# Altium project GameBoard_V1I1.PrjPcb (part 9 of 20)

## Sheet [14] - MCU.SchDoc
size A2; DocumentNumber: 14; SheetNumber: 14; SheetTotal: 32
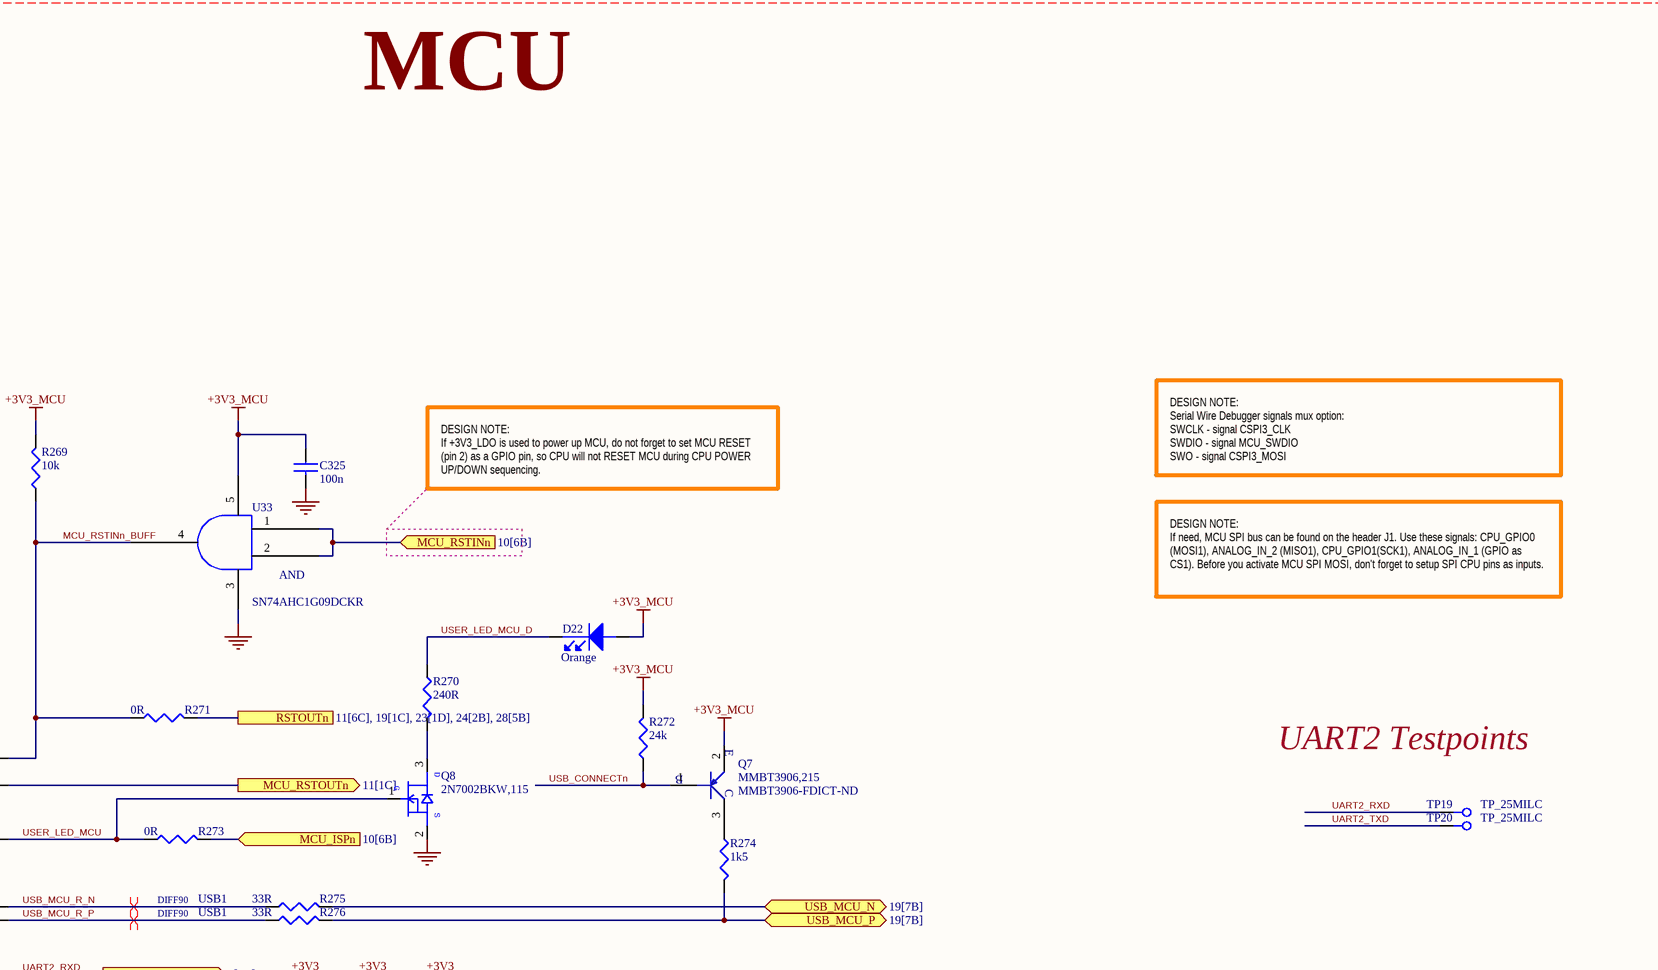
[diagram p54: [14] - MCU.SchDoc, top right]
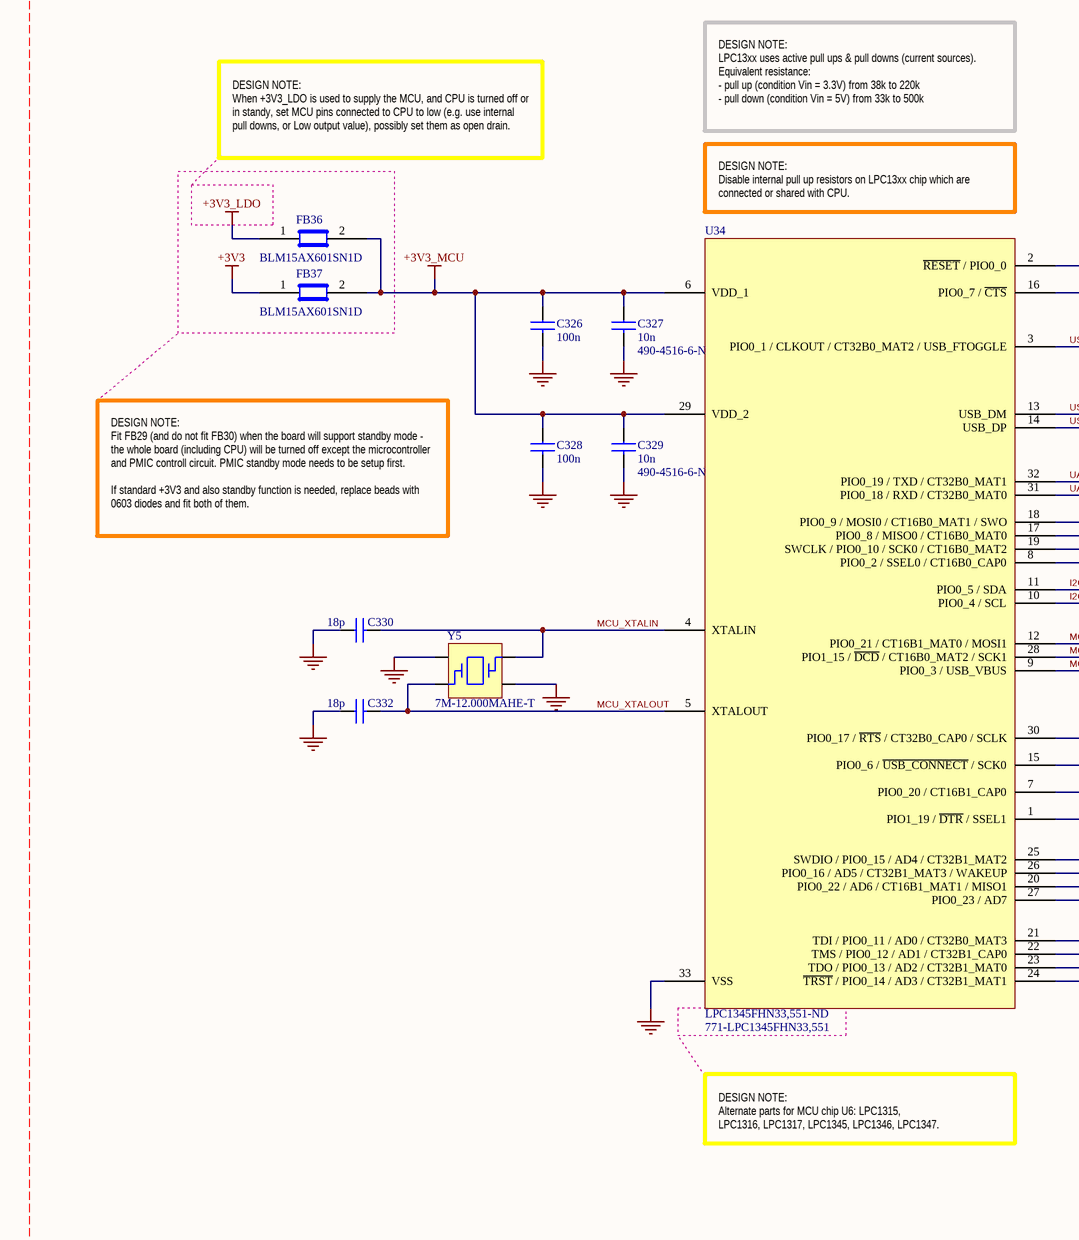
[diagram p55: [14] - MCU.SchDoc, bottom left]
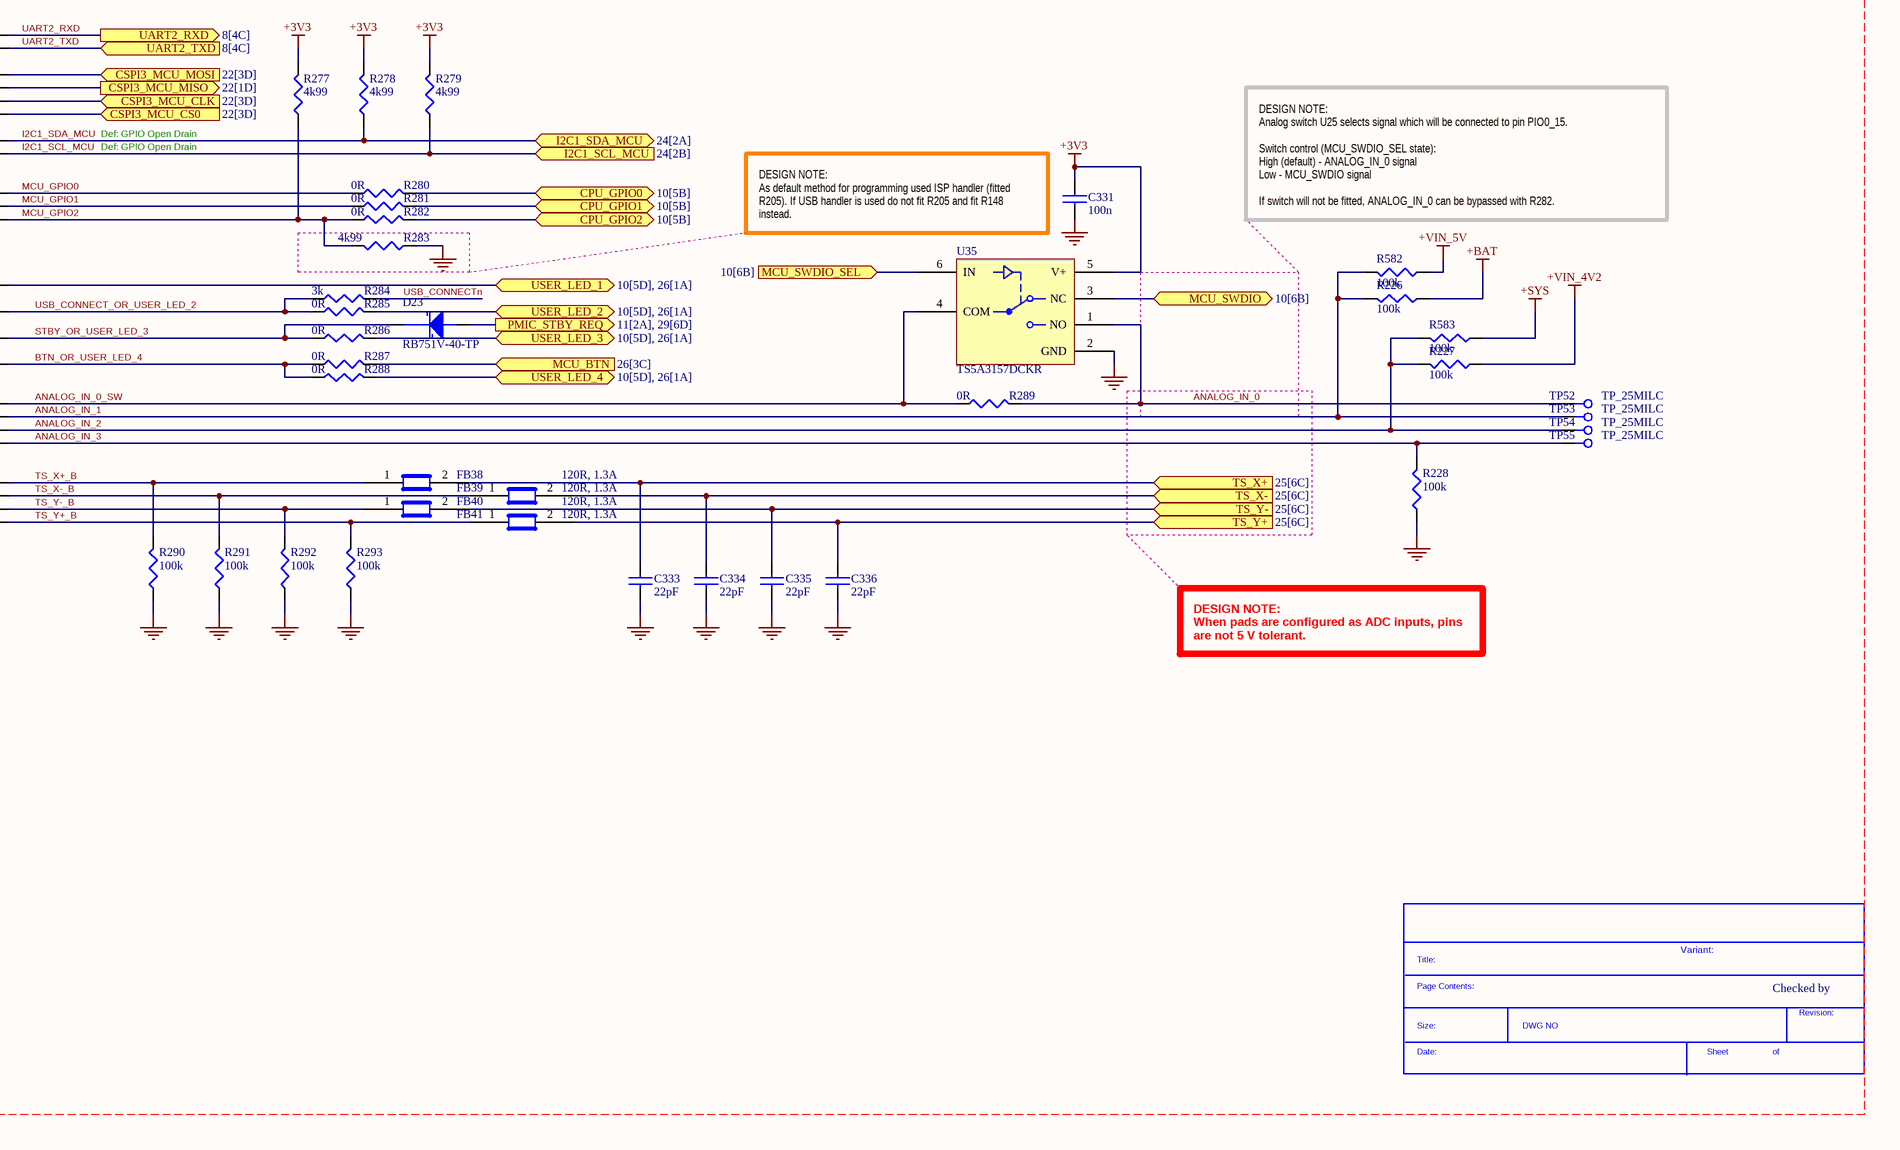
[diagram p56: [14] - MCU.SchDoc, bottom right]

### Parts
(Parts that share a designator on the sheet are numbered #1, #2 ... from top to bottom, then left to right.)
*#18  SDTitleBlock  (value not drawn)  (graphical)
C325  100n  [C0402]
C326  100n  [C0402]
C327  10n  Supplier Part Number 2: 490-4516-6-ND  [C0402]
C328  100n  [C0402]
C329  10n  Supplier Part Number 2: 490-4516-6-ND  [C0402]
C330  18p  [C0402]
C331  100n  [C0402]
C332  18p  [C0402]
C333  22pF  [C0402]
C334  22pF  [C0402]
C335  22pF  [C0402]
C336  22pF  [C0402]
D22  Orange  [LED_0603]
D23  RB751V-40-TP  [SOD323]
FB36  BLM15AX601SN1D  [C0402]
FB37  BLM15AX601SN1D  [C0402]
FB38  120R, 1.3A  [C0402]
FB39  120R, 1.3A  [C0402]
FB40  120R, 1.3A  [C0402]
FB41  120R, 1.3A  [C0402]
Q7  MMBT3906,215  Supplier Part Number 2: MMBT3906-FDICT-ND  [SOT-23-3-123]
Q8  2N7002BKW,115  [SC70_SOT323]
R226  100k  [R0402]
R227  100k  [R0402]
R228  100k  [R0402]
R269  10k  [R0402]
R270  240R  [R0402]
R271  0R  [R0402]
R272  24k  [R0402]
R273  0R  [R0402]
R274  1k5  [R0402]
R275  33R  [R0402]
R276  33R  [R0402]
R277  4k99  [R0402]
R278  4k99  [R0402]
R279  4k99  [R0402]
R280  0R  [R0402]
R281  0R  [R0402]
R282  0R  [R0402]
R283  4k99  [R0402]
R284  3k  [R0402]
R285  0R  [R0402]
R286  0R  [R0402]
R287  0R  [R0402]
R288  0R  [R0402]
R289  0R  [R0402]
R290  100k  [R0402]
R291  100k  [R0402]
R292  100k  [R0402]
R293  100k  [R0402]
R582  100k  [R0402]
R583  100k  [R0402]
TP19  TP_25MILC  [TP_25C]  (no BOM)
TP20  TP_25MILC  [TP_25C]  (no BOM)
TP52  TP_25MILC  [TP_25C]  (no BOM)
TP53  TP_25MILC  [TP_25C]  (no BOM)
TP54  TP_25MILC  [TP_25C]  (no BOM)
TP55  TP_25MILC  [TP_25C]  (no BOM)
U33  SN74AHC1G09DCKR  [SC70_5]
U34  LPC1345FHN33,551-ND  Supplier Part Number 2: 771-LPC1345FHN33,551  [HVQFN33_7x7mm]
U35  TS5A3157DCKR  [SC70_6]
Y5  7M-12.000MAHE-T  [7M]

### Ports
CPU_GPIO0 (bidir, see 10[5B]), CPU_GPIO1 (bidir, see 10[5B]), CPU_GPIO2 (bidir, see 10[5B]), CSPI3_MCU_CLK (in, see 22[3D]), CSPI3_MCU_CS0 (in, see 22[3D]), CSPI3_MCU_MISO (out, see 22[1D]), CSPI3_MCU_MOSI (in, see 22[3D]), I2C1_SCL_MCU (in, see 24[2B]), I2C1_SDA_MCU (bidir, see 24[2A]), MCU_BTN (in, see 26[3C]), MCU_ISPn (in, see 10[6B]), MCU_RSTINn (in, see 10[6B]), MCU_RSTOUTn (out, see 11[1C]), MCU_SWDIO (bidir, see 10[6B]), MCU_SWDIO_SEL (in, see 10[6B]), PMIC_STBY_REQ (out, see 11[2A], 29[6D]), RSTOUTn (see 11[6C], 19[1C], 23[1D], 24[2B], 28[5B]), TS_X+ (in, see 25[6C]), TS_X- (in, see 25[6C]), TS_Y+ (in, see 25[6C]), TS_Y- (in, see 25[6C]), UART2_RXD (out, see 8[4C]), UART2_TXD (in, see 8[4C]), USB_MCU_N (bidir, see 19[7B]), USB_MCU_P (bidir, see 19[7B]), USER_LED_1 (bidir, see 10[5D], 26[1A]), USER_LED_2 (bidir, see 10[5D], 26[1A]), USER_LED_3 (bidir, see 10[5D], 26[1A]), USER_LED_4 (bidir, see 10[5D], 26[1A])

### Nets
+3V3: C331.1 FB37.1 R277.2 R278.2 R279.2 U35.5(V+)
+3V3_LDO: FB36.1
+3V3_MCU: C325.1 C326.1 C327.1 C328.1 C329.1 D22.2(ANODE) FB36.2 FB37.2 Q7.2(E) R269.2 R272.2 U33.5(VCC) U34.6(VDD_1) U34.29(VDD_2)
+BAT: R226.1
+SYS: R583.1
+VIN_4V2: R227.1
+VIN_5V: R582.1
GND: C325.2 C326.2 C327.2 C328.2 C329.2 C330.1 C331.2 C332.1 C333.2 C334.2 C335.2 C336.2 Q8.2(SOURCE) R228.1 R283.1 R290.1 R291.1 R292.1 R293.1 U33.3(GND) U34.33(VSS) U35.2(GND) Y5.2 Y5.4
ANALOG_IN_0: R289.2 TP52.1 U35.1(NO)
ANALOG_IN_0_SW: R289.1 U34.25(SWDIO_/_PIO0_15_/_AD4_/_CT32B1_MAT2) U35.4(COM)
ANALOG_IN_1: R226.2 R582.2 TP53.1 U34.26(PIO0_16_/_AD5_/_CT32B1_MAT3_/_WAKEUP)
ANALOG_IN_2: R227.2 R583.2 TP54.1 U34.20(PIO0_22_/_AD6_/_CT16B1_MAT1_/_MISO1)
ANALOG_IN_3: R228.2 TP55.1 U34.27(PIO0_23_/_AD7)
BTN_OR_USER_LED_4: R287.1 R288.1 U34.1(PIO1_19_/_~{DTR}_/_SSEL1)
CPU_GPIO0: R280.2 ; port CPU_GPIO0
CPU_GPIO1: R281.2 ; port CPU_GPIO1
CPU_GPIO2: R282.2 ; port CPU_GPIO2
CSPI3_MCU_CLK: U34.19(SWCLK_/_PIO0_10_/_SCK0_/_CT16B0_MAT2) ; port CSPI3_MCU_CLK
CSPI3_MCU_CS0: U34.8(PIO0_2_/_SSEL0_/_CT16B0_CAP0) ; port CSPI3_MCU_CS0
CSPI3_MCU_MISO: U34.17(PIO0_8_/_MISO0_/_CT16B0_MAT0) ; port CSPI3_MCU_MISO
CSPI3_MCU_MOSI: U34.18(PIO0_9_/_MOSI0_/_CT16B0_MAT1_/_SWO) ; port CSPI3_MCU_MOSI
I2C1_SCL_MCU: R279.1 U34.10(PIO0_4_/_SCL) ; port I2C1_SCL_MCU
I2C1_SDA_MCU: R278.1 U34.11(PIO0_5_/_SDA) ; port I2C1_SDA_MCU
MCU_BTN: R287.2 ; port MCU_BTN
MCU_GPIO0: R280.1 U34.12(PIO0_21_/_CT16B1_MAT0_/_MOSI1)
MCU_GPIO1: R281.1 U34.28(PIO1_15_/_~{DCD}_/_CT16B0_MAT2_/_SCK1)
MCU_GPIO2: R277.1 R282.1 R283.2 U34.9(PIO0_3_/_USB_VBUS)
MCU_ISPn: R273.2 ; port MCU_ISPn
MCU_RSTINn: U33.1(A) U33.2(B) ; port MCU_RSTINn
MCU_RSTINn_BUFF: R269.1 R271.1 U33.4(Y) U34.2(~{RESET}_/_PIO0_0)
MCU_RSTOUTn: U34.16(PIO0_7_/_~{CTS}) ; port MCU_RSTOUTn
MCU_SWDIO: U35.3(NC) ; port MCU_SWDIO
MCU_SWDIO_SEL: U35.6(IN) ; port MCU_SWDIO_SEL
MCU_XTALIN: C330.2 U34.4(XTALIN) Y5.1
MCU_XTALOUT: C332.2 U34.5(XTALOUT) Y5.3
PMIC_STBY_REQ: D23.2(ANODE) ; port PMIC_STBY_REQ
RSTOUTn: R271.2 ; port RSTOUTn
STBY_OR_USER_LED_3: D23.1(cathode) R286.1 U34.7(PIO0_20_/_CT16B1_CAP0)
TS_X+: C333.1 FB38.2 ; port TS_X+
TS_X+_B: FB38.1 R290.2 U34.21(TDI_/_PIO0_11_/_AD0_/_CT32B0_MAT3)
TS_X-: C334.1 FB39.2 ; port TS_X-
TS_X-_B: FB39.1 R291.2 U34.22(TMS_/_PIO0_12_/_AD1_/_CT32B1_CAP0)
TS_Y+: C336.1 FB41.2 ; port TS_Y+
TS_Y+_B: FB41.1 R293.2 U34.24(~{TRST}_/_PIO0_14_/_AD3_/_CT32B1_MAT1)
TS_Y-: C335.1 FB40.2 ; port TS_Y-
TS_Y-_B: FB40.1 R292.2 U34.23(TDO_/_PIO0_13_/_AD2_/_CT32B1_MAT0)
UART2_RXD: TP19.1 U34.32(PIO0_19_/_TXD_/_CT32B0_MAT1) ; port UART2_RXD
UART2_TXD: TP20.1 U34.31(PIO0_18_/_RXD_/_CT32B0_MAT0) ; port UART2_TXD
USB_CONNECT_OR_USER_LED_2: R284.1 R285.1 U34.15(PIO0_6_/_~{USB_CONNECT}_/_SCK0)
USB_CONNECTn: Q7.1(B) R272.1 R284.2
USB_MCU_N: R275.2 ; port USB_MCU_N
USB_MCU_P: R274.2 R276.2 ; port USB_MCU_P
USB_MCU_R_N: R275.1 U34.13(USB_DM)
USB_MCU_R_P: R276.1 U34.14(USB_DP)
USER_LED_1: U34.30(PIO0_17_/_~{RTS}_/_CT32B0_CAP0_/_SCLK) ; port USER_LED_1
USER_LED_2: R285.2 ; port USER_LED_2
USER_LED_3: R286.2 ; port USER_LED_3
USER_LED_4: R288.2 ; port USER_LED_4
USER_LED_MCU: Q8.1(GATE) R273.1 U34.3(PIO0_1_/_CLKOUT_/_CT32B0_MAT2_/_USB_FTOGGLE)
USER_LED_MCU_D: D22.1(cathode) R270.1
NetQ7_3: Q7.3(C) R274.1
NetQ8_3: Q8.3(DRAIN) R270.2

### Layout directives
differential pair; net class DIFF90; net class USB1: USB_MCU_R_N, USB_MCU_R_P
net class [14] - MCU: +3V3, +3V3_LDO, +3V3_MCU, +BAT, +SYS, +VIN_4V2, +VIN_5V, ANALOG_IN_0, ANALOG_IN_0_SW, ANALOG_IN_1, ANALOG_IN_2, ANALOG_IN_3, BTN_OR_USER_LED_4, GND, I2C1_SCL_MCU, I2C1_SDA_MCU, MCU_GPIO0, MCU_GPIO1, MCU_GPIO2, MCU_RSTINn_BUFF, MCU_XTALIN, MCU_XTALOUT, STBY_OR_USER_LED_3, TS_X+_B, TS_X-_B, TS_Y+_B, TS_Y-_B, UART2_RXD, UART2_TXD, USB_CONNECT_OR_USER_LED_2, USB_CONNECTn, USB_MCU_R_N, USB_MCU_R_P, USER_LED_MCU, USER_LED_MCU_D

### Notes on the sheet
- MCU
- DESIGN NOTE:
  If +3V3_LDO is used to power up MCU, do not forget to set MCU RESET (pin 2) as a GPIO pin, so CPU will not RESET MCU during CPU POWER UP/DOWN sequencing.
- DESIGN NOTE:
  Serial Wire Debugger signals mux option:
  SWCLK - signal CSPI3_CLK
  SWDIO - signal MCU_SWDIO
  SWO - signal CSPI3_MOSI
- DESIGN NOTE:
  LPC13xx uses active pull ups & pull downs (current sources).
  Equivalent resistance:
  - pull up (condition Vin = 3.3V) from 38k to 220k
  - pull down (condition Vin = 5V) from 33k to 500k
- DESIGN NOTE:
  If need, MCU SPI bus can be found on the header J1. Use these signals: CPU_GPIO0 (MOSI1), ANALOG_IN_2 (MISO1), CPU_GPIO1(SCK1), ANALOG_IN_1 (GPIO as CS1). Before you activate MCU SPI MOSI, don't forget to setup SPI CPU pins as inputs.
- DESIGN NOTE:
  When +3V3_LDO is used to supply the MCU, and CPU is turned off or in standy, set MCU pins connected to CPU to low (e.g. use internal pull downs, or Low output value), possibly set them as open drain.
- DESIGN NOTE:
  Disable internal pull up resistors on LPC13xx chip which are connected or shared with CPU.
- UART2 Testpoints
- DESIGN NOTE:
  Fit FB29 (and do not fit FB30) when the board will support standby mode - the whole board (including CPU) will be turned off except the microcontroller and PMIC controll circuit. PMIC standby mode needs to be setup first.
  If standard +3V3 and also standby function is needed, replace beads with 0603 diodes and fit both of them.
- Def: GPIO Open Drain
- DESIGN NOTE:
  Analog switch U25 selects signal which will be connected to pin PIO0_15.
  Switch control (MCU_SWDIO_SEL state):
  High (default) - ANALOG_IN_0 signal
  Low - MCU_SWDIO signal
  If switch will not be fitted, ANALOG_IN_0 can be bypassed with R282.
- DESIGN NOTE:
  As default method for programming used ISP handler (fitted R205). If USB handler is used do not fit R205 and fit R148 instead.
- DESIGN NOTE:
  Alternate parts for MCU chip U6: LPC1315,
  LPC1316, LPC1317, LPC1345, LPC1346, LPC1347.
- DESIGN NOTE:
  When pads are configured as ADC inputs, pins are not 5 V tolerant.
- Variant:
- Checked by
- (in symbol 2N7002BKW,115) D; G; S
- (in symbol SDTitleBlock) Title:; Page Contents:; Revision:; Size:; DWG NO; Date:; Sheet; of
- (in symbol SN74AHC1G09DCKR) AND

### Library data of the parts
C325 C326 C328 C331 = C1005X5R1H104K: as C241 on sheet [19] - USB; Category: Capacitors; Manufacturer Part Number: C1005X5R1H104K; Operating Temperature: -55°C ~ 85°C; Package / Case: 0402 (1005 Metric); Price 1k [$]: 0.02340; .Checked SCH: used; Voltage - Rated: 50V; Supplier Part Number: 445-5942-1-ND; Supplier: Digikey; Supplier 1: Digi-Key; Supplier Part Number 1: 445-5942-1-ND; RoHS: RoHS Compliant; Stock 1: 106926; Pricing 1: 1=0.27, 10=0.18, 100=0.072, 250=0.05176, 500=0.0369, 1000=0.027 (USD); Tolerance: ±10%; Temperature Coefficient: X5R; Mounting Type: Surface Mount, MLCC; Applications: General Purpose; Ratings: -; Size / Dimension: 0.039" L x 0.020" W (1.00mm x 0.50mm); Height - Seated (Max): -; Thickness (Max): 0.022" (0.55mm); Lead Spacing: -; Features: -; Packaging: Cut Tape (CT); Lead Style: -; ComponentLink1URL: http://www.tdk.co.jp/tefe02/e412_c.pdf; ComponentLink1Description: http://www.tdk.co.jp/tefe02/e412_c.pdf; Supplier 2: Digi-Key; Supplier Part Number 2: 311-1697-6-ND
C327 C329 = C1005X7R1H103K: CAP CER 10000PF 50V 10% X7R 0402; Manufacturer: TDK Corporation; Value: 10nF; .Checked PCB: used; Capacitance: 10000pF; Category: Capacitors; Supplier Part Number: 445-6850-1-ND; Manufacturer Part Number: C1005X7R1H103K; Operating Temperature: -55°C ~ 125°C; Package / Case: 0402 (1005 Metric); Price 1k [$]: 0.01625; .Checked SCH: used; Voltage - Rated: 50V; Supplier: Digikey; Supplier 1: Digi-Key; Supplier Part Number 1: 445-6850-1-ND; RoHS: RoHS Compliant; Stock 1: 3901; Pricing 1: 1=0.2, 10=0.125, 100=0.045, 250=0.03252, 500=0.024, 1000=0.01625 (USD); Tolerance: ±10%; Temperature Coefficient: X7R; Mounting Type: Surface Mount, MLCC; Applications: General Purpose; Ratings: -; Size / Dimension: 0.039" L x 0.020" W (1.00mm x 0.50mm); Height - Seated (Max): -; Thickness (Max): 0.022" (0.55mm); Lead Spacing: -; Features: -; Packaging: Cut Tape (CT); Lead Style: -; ComponentLink1URL: http://www.tdk.co.jp/tefe02/e412_c.pdf; ComponentLink1Description: http://www.tdk.co.jp/tefe02/e412_c.pdf; Supplier 2: Digi-Key
C330 C332 = C1005C0G1H180J: as C247 on sheet [19] - USB; Capacitance: 18pF; Category: Capacitors; Supplier Part Number: 445-1238-1-ND; Manufacturer Part Number: C1005C0G1H180J; Operating Temperature: -55°C ~ 125°C; Package / Case: 0402 (1005 Metric); Price 1k [$]: 0.00468; Value: 18pF; .Checked SCH: used; Voltage - Rated: 50V; Supplier: Digikey; Supplier 1: Digi-Key; Supplier Part Number 1: 445-1238-1-ND; RoHS: RoHS Compliant; Stock 1: 24321; Pricing 1: 1=0.08, 10=0.05, 100=0.018, 250=0.013, 500=0.0096, 1000=0.0065 (USD); Tolerance: ±5%; Mounting Type: Surface Mount, MLCC; Applications: General Purpose; Ratings: -; Size / Dimension: 0.039" L x 0.020" W (1.00mm x 0.50mm); Height - Seated (Max): -; Thickness (Max): 0.022" (0.55mm); Lead Spacing: -; Features: -; Packaging: Cut Tape (CT); Lead Style: -; ComponentLink1URL: http://www.tdk.co.jp/tefe02/e412_c.pdf; ComponentLink1Description: http://www.tdk.co.jp/tefe02/e412_c.pdf
C333-C336 = C1005C0G1H220J: CAP CER 22PF 50V C0G 5% 0402; Manufacturer: TDK Corporation; .Checked PCB: used; Temperature Coefficient: C0G, NP0; Capacitance: 22pF; Category: Capacitors; Supplier Part Number: 445-1239-1-ND; Manufacturer Part Number: C1005C0G1H220J; Operating Temperature: -55°C ~ 125°C; Package / Case: 0402 (1005 Metric); Price 1k [$]: 0.00442; Value: 22pF; .Checked SCH: used; Voltage - Rated: 50V; Supplier: Digikey; Supplier 1: Digi-Key; Supplier Part Number 1: 445-1239-1-ND; RoHS: RoHS Compliant; Stock 1: 176261; Pricing 1: 1=0.08, 10=0.05, 100=0.018, 250=0.013, 500=0.0096, 1000=0.0065 (USD); Tolerance: ±5%; Mounting Type: Surface Mount, MLCC; Applications: General Purpose; Ratings: -; Size / Dimension: 0.039" L x 0.020" W (1.00mm x 0.50mm); Height - Seated (Max): -; Thickness (Max): 0.022" (0.55mm); Lead Spacing: -; Features: -; Packaging: Cut Tape (CT); Lead Style: -; ComponentLink1URL: http://www.tdk.co.jp/tefe02/e412_c.pdf; ComponentLink1Description: http://www.tdk.co.jp/tefe02/e412_c.pdf
D22 = LO L29K-H2K1-24-Z: as D11 on sheet [19] - USB; Supplier 1: Digi-Key; Supplier Part Number 1: 475-2740-1-ND; Manufacturer Part Number: LO L29K-H2K1-24-Z; RoHS: RoHS Compliant; Category: Optoelectronics; Stock 1: 15900; Pricing 1: 1=0.17, 10=0.141, 100=0.1127, 250=0.0986, 500=0.09016 (USD); Color: Orange; Wavelength - Dominant: 606nm; Package / Case: 0603 (1608 Metric); Size / Dimension: 1.70mm L x 0.80mm W; Height: 0.65mm; Mounting Type: Surface Mount; Packaging: Cut Tape (CT); ComponentLink1URL: http://catalog.osram-os.com/catalogue/catalogue.do;jsessionid=302CF83AF637AE24E40AEB0ADA267EDD?act=downloadFile&favOid=020000010003f9de000100b6; ComponentLink1Description: http://catalog.osram-os.com/catalogue/catalogue.do;jsessionid=302CF83AF637AE24E40AEB0ADA267EDD?act=downloadFile&favOid=020000010003f9de000100b6; .Checked SCH: used
D23 = RB751V-40-TP: DIODE SCHTKY 30MA 30V SOD-323; Manufacturer: Micro Commercial Co; Diode Type: Schottky; Voltage - Forward (Vf) (Max) @ If: 370mV @ 1mA; Speed: Small Signal =< 200mA (Io), Any Speed; Current - Reverse Leakage @ Vr: 500nA @ 30V; Capacitance @ Vr, F: 2pF @ 1V, 1MHz; .Checked PCB: used; Supplier 1: Digi-Key; Supplier Part Number 1: RB751V-40-TPMSCT-ND; Manufacturer Part Number: RB751V-40-TP; RoHS: RoHS Compliant; Category: Discrete Semiconductor Products; Stock 1: 18964; Pricing 1: 1=0.48, 10=0.342, 100=0.2014, 250=0.14252, 500=0.1216, 1000=0.095 (USD); Voltage - DC Reverse (Vr) (Max): 30V; Current - Average Rectified (Io): 30mA; Reverse Recovery Time (trr): -; Mounting Type: Surface Mount; Package / Case: SC-76, SOD-323; Supplier Device Package: SOD-323; Packaging: Cut Tape (CT); ComponentLink1URL: http://www.mccsemi.com/up_pdf/RB751V-40(SOD-323).PDF; ComponentLink1Description: Data Sheet; .Checked SCH: used
FB36 FB37 = BLM15AX601SN1D: FERRITE CHIP 600 OHM 0402 420mA; Manufacturer: Murata Electronics North America; .Checked PCB: used; Impedance @ Frequency: 600 Ohm @ 100MHz; DC Resistance (DCR): 340 mOhm Max; Filter Type: Differential Mode - Single; Number of Lines: 1; .Checked SCH: used; Category: Filters; Manufacturer Part Number: BLM15AX601SN1D; Package / Case: 0402 (1005 Metric); Current Rating: 420mA; Supplier 1: Digi-Key; Supplier Part Number 1: 490-5441-1-ND; RoHS: RoHS Compliant; Stock 1: 34008; Pricing 1: 1=0.26, 10=0.197, 50=0.1148, 100=0.0918, 250=0.0656, 500=0.0446, 1000=0.03608, 5000=0.02821 (USD); Mounting Type: Surface Mount; Packaging: Cut Tape (CT); Height (Max): 0.022" (0.55mm); Size / Dimension: 0.039" L x 0.020" W (1.00mm x 0.50mm); ComponentLink1URL: http://search.murata.co.jp/Ceramy/image/img/PDF/ENG/L0110S0100BLM15AX_SN.pdf; ComponentLink1Description: http://search.murata.co.jp/Ceramy/image/img/PDF/ENG/L0110S0100BLM15AX_SN.pdf; Supplier Part Number: 490-5441-1-ND; Price 1k [$]: 0.03280; Value: BLM15AX601SN1D; Supplier: Digikey
FB38-FB41 = BLM15PD121SN1D: FERRITE CHIP 120 OHM 1300MA 0402; Manufacturer: Murata Electronics North America; Impedance @ Frequency: 120 Ohm @ 100MHz; DC Resistance (DCR): 90 mOhm Max; Filter Type: Differential Mode - Single; .Checked PCB: used; .Creator: MM; Supplier 1: Digi-Key; Manufacturer Part Number: BLM15PD121SN1D; RoHS: RoHS Compliant; Category: Filters; Stock 1: 478960; Pricing 1: 1=0.12, 10=0.096, 50=0.0636, 100=0.0549, 250=0.04332, 500=0.03658, 1000=0.0308, 5000=0.02743 (USD); Packaging: Cut Tape (CT); Current Rating: 1.3A; Package / Case: 0402 (1005 Metric); Mounting Type: Surface Mount; Height (Max): 0.022" (0.55mm); Size / Dimension: 0.039" L x 0.020" W (1.00mm x 0.50mm); ComponentLink1URL: http://media.digikey.com/pdf/Data%20Sheets/Murata%20PDFs/BLM15P_Series.pdf; ComponentLink1Description: http://media.digikey.com/pdf/Data%20Sheets/Murata%20PDFs/BLM15P_Series.pdf; Supplier Part Number 1: 490-5203-1-ND; .Checked SCH: used
Q7 = MMBT3906,215: TRANS PNP 40V 0.2A SOT23; Manufacturer: NXP Semiconductors; Current - Collector (Ic) (Max): 200mA; Vce Saturation (Max) @ Ib, Ic: 400mV @ 5mA, 50mA; DC Current Gain (hFE) (Min) @ Ic, Vce: 100 @ 10mA, 1V; Power - Max: 250mW; Frequency - Transition: 250MHz; .Checked PCB: used; .Creator: MM; Supplier 1: Digi-Key; Manufacturer Part Number: MMBT3906,215; RoHS: RoHS Compliant; Category: Discrete Semiconductor Products; Stock 1: 39823; Pricing 1: 1=0.14, 10=0.125, 25=0.1132, 100=0.0816, 250=0.04804, 500=0.03986, 1000=0.02719 (USD); Packaging: Cut Tape (CT); Transistor Type: PNP; Voltage - Collector Emitter Breakdown (Max): 40V; Current - Collector Cutoff (Max): -; Mounting Type: Surface Mount; Package / Case: TO-236-3, SC-59, SOT-23-3; Supplier Device Package: SOT-23 (TO-236AB); ComponentLink1URL: http://www.nxp.com/documents/data_sheet/MMBT3906.pdf; ComponentLink1Description: http://www.nxp.com/documents/data_sheet/MMBT3906.pdf; Supplier Part Number 1: 568-4511-1-ND; .Checked SCH: used; Supplier 2: Digi-Key
Q8 = 2N7002BKW,115: MOSFET N-CH 60V 310MA SOT323; Manufacturer: NXP Semiconductors; FET Type: MOSFET N-Channel, Metal Oxide; FET Feature: Logic Level Gate; Rds On (Max) @ Id, Vgs: 1.6 Ohm @ 500mA, 10V; Vgs(th) (Max) @ Id: 2.1V @ 250µA; Gate Charge (Qg) @ Vgs: 0.6nC @ 4.5V; Input Capacitance (Ciss) @ Vds: 50pF @ 10V; Power - Max: 275mW; .Checked PCB: used; Supplier 1: Digi-Key; Supplier Part Number 1: 1727-4788-1-ND; Manufacturer Part Number: 2N7002BKW,115; RoHS: RoHS Compliant; Category: Discrete Semiconductor Products; Drain to Source Voltage (Vdss): 60V; Current - Continuous Drain (Id) @ 25° C: 310mA; Mounting Type: Surface Mount; Package / Case: SC-70, SOT-323; Supplier Device Package: SC-70; Packaging: Cut Tape (CT); ComponentLink1URL: http://www.nxp.com/documents/data_sheet/2N7002BKW.pdf; ComponentLink1Description: http://www.nxp.com/documents/data_sheet/2N7002BKW.pdf; .Checked SCH: used
R226-R228 R290-R293 R582 R583 = RMCF0402FT100K: as R183 on sheet [19] - USB; Category: Resistors; Supplier Part Number: RMCF0402FT100KCT-ND; Manufacturer Part Number: RMCF0402FT100K; Package / Case: 0402 (1005 Metric); Price 1k [$]: 0.00384; Resistance (Ohms): 100K; Tolerance: ±1%; Value: 100k; .Checked SCH: used; Supplier: Digikey; Supplier 1: Digi-Key; Supplier Part Number 1: YAG1343DKR-ND; RoHS: RoHS Compliant; Composition: Thick Film; Features: -; Size / Dimension: 0.039" L x 0.020" W (1.00mm x 0.50mm); Height: 0.016" (0.40mm); Number of Terminations: 2; Packaging: Cut Tape (CT); ComponentLink1URL: http://www.seielect.com/Catalog/SEI-RMCF.pdf; ComponentLink1Description: http://www.seielect.com/Catalog/SEI-RMCF.pdf
R269 = RC0402FR-0710KL: as R173 on sheet [19] - USB; Category: Resistors; Supplier Part Number: 311-10.0KLRCT-ND; Manufacturer Part Number: RC0402FR-0710KL; Package / Case: 0402 (1005 Metric); Price 1k [$]: 0.01421; Resistance (Ohms): 10K; Tolerance: ±1%; Value: 10k; .Checked SCH: used; Supplier: Digikey; Supplier 1: Digi-Key; Supplier Part Number 1: 311-10.0KLRCT-ND; RoHS: RoHS Compliant; Stock 1: 2916495; Pricing 1: 10=0.014, 50=0.0104, 100=0.0079, 250=0.00584, 500=0.00432, 1000=0.00288 (USD); Composition: Thick Film; Features: -; Size / Dimension: 0.039" L x 0.020" W (1.00mm x 0.50mm); Height: 0.016" (0.40mm); Number of Terminations: 2; Packaging: Cut Tape (CT); ComponentLink1URL: http://www.yageo.com/documents/recent/PYu-RC0402_51_RoHS_L_6.pdf; ComponentLink1Description: http://www.yageo.com/documents/recent/PYu-RC0402_51_RoHS_L_6.pdf
R270 = RMCF0402FT240R: RES TF 240 OHM 1% 0.0625W 0402; Manufacturer: Stackpole Electronics Inc; Resistance (Ohms): 240; Power (Watts): 0.063W, 1/16W; .Checked PCB: used; Temperature Coefficient: ±100ppm/°C; Category: Resistors; Supplier Part Number: RMCF0402FT240RCT-ND; Manufacturer Part Number: RMCF0402FT240R; Package / Case: 0402 (1005 Metric); Price 1k [$]: 0.00384; Tolerance: ±1%; Value: 240R; .Checked SCH: used; Supplier: Digikey; Supplier 1: Digi-Key; Supplier Part Number 1: RMCF0402FT240RCT-ND; RoHS: RoHS Compliant; Stock 1: 39860; Pricing 1: 1=0.04, 10=0.025, 50=0.0138, 100=0.0105, 250=0.0078, 500=0.00576, 1000=0.00384 (USD); Composition: Thick Film; Features: -; Size / Dimension: 0.039" L x 0.020" W (1.00mm x 0.50mm); Height: 0.016" (0.40mm); Number of Terminations: 2; Packaging: Cut Tape (CT); ComponentLink1URL: http://www.seielect.com/Catalog/SEI-RMCF.pdf; ComponentLink1Description: http://www.seielect.com/Catalog/SEI-RMCF.pdf
R271 R273 R280-R282 R285-R289 = RC0402JR-070RL: as R157-R160 on sheet [19] - USB; Category: Resistors; Supplier Part Number: 311-0.0JRCT-ND; Manufacturer Part Number: RC0402JR-070RL; Package / Case: 0402 (1005 Metric); Price 1k [$]: 0.01389; Value: 0R; .Checked SCH: used; Supplier: Digikey; Supplier 1: Digi-Key; Supplier Part Number 1: 311-0.0JRCT-ND; RoHS: RoHS Compliant; Stock 1: 1106330; Pricing 1: 10=0.012, 50=0.009, 100=0.0069, 250=0.00512, 500=0.0038, 1000=0.00253 (USD); Composition: Thick Film; Features: -; Temperature Coefficient: -; Size / Dimension: 0.039" L x 0.020" W (1.00mm x 0.50mm); Height: 0.016" (0.40mm); Number of Terminations: 2; Packaging: Cut Tape (CT); ComponentLink1URL: http://www.yageo.com/documents/recent/PYu-RC0402_51_RoHS_L_6.pdf; ComponentLink1Description: http://www.yageo.com/documents/recent/PYu-RC0402_51_RoHS_L_6.pdf
R272 = RC0402FR-0724KL: RES 24K OHM 1% 1/16W 0402; Manufacturer: Yageo; Power (Watts): 0.063W, 1/16W; Temperature Coefficient: ±100ppm/°C; .Creator: MM; .Checked PCB: used; Supplier 1: Digi-Key; Manufacturer Part Number: RC0402FR-0724KL; RoHS: RoHS Compliant; Category: Resistors; Stock 1: 85479; Pricing 1: 1=0.1, 10=0.013, 25=0.0096, 100=0.0054, 250=0.00412, 500=0.00328, 1000=0.00242, 2500=0.0021, 5000=0.00173 (USD); Packaging: Cut Tape (CT); Resistance (Ohms): 24k; Tolerance: ±1%; Composition: Thick Film; Features: Moisture Resistant; Operating Temperature: -55°C ~ 155°C; Package / Case: 0402 (1005 Metric); Supplier Device Package: 0402; Size / Dimension: 0.039" L x 0.020" W (1.00mm x 0.50mm); Height: 0.016" (0.40mm); Number of Terminations: 2; ComponentLink1URL: http://www.yageo.com/NewPortal/yageodocoutput?fileName=/pdf/R-Chip/PYu-RC_Group_51_RoHS_L_3.pdf; ComponentLink1Description: http://www.yageo.com/NewPortal/yageodocoutput?fileName=/pdf/R-Chip/PYu-RC_Group_51_RoHS_L_3.pdf; Supplier Part Number 1: 311-24KLRCT-ND; .Checked SCH: used; Supplier 2: Digi-Key; Supplier Part Number 2: P24KDCCT-ND
R274 = RC0402FR-071K5L: RES 1.50K OHM 1/16W 1% 0402 SMD; Manufacturer: Yageo; Resistance (Ohms): 1.5k; Power (Watts): 0.063W, 1/16W; Temperature Coefficient: ±100ppm/°C; .Creator: MM; .Checked PCB: used; Supplier 1: Digi-Key; Manufacturer Part Number: RC0402FR-071K5L; RoHS: RoHS Compliant; Category: Resistors; Stock 1: 499348; Pricing 1: 1=0.1, 10=0.014, 25=0.0104, 100=0.0063, 250=0.0054, 500=0.00382, 1000=0.0027, 2500=0.00234, 5000=0.00203 (USD); Packaging: Cut Tape (CT); Tolerance: ±1%; Composition: Thick Film; Features: -; Package / Case: 0402 (1005 Metric); Supplier Device Package: 0402; Size / Dimension: 0.039" L x 0.020" W (1.00mm x 0.50mm); Height: 0.016" (0.40mm); Number of Terminations: 2; ComponentLink1URL: http://www.yageo.com/documents/recent/PYu-RC0402_51_RoHS_L_6.pdf; ComponentLink1Description: http://www.yageo.com/documents/recent/PYu-RC0402_51_RoHS_L_6.pdf; Supplier Part Number 1: 311-1.50KLRCT-ND; .Checked SCH: used
R275 R276 = RMCF0402FT33R0: RES TF 33 OHM 1% 1/16W 0402; Manufacturer: Stackpole Electronics Inc; Resistance (Ohms): 33; Power (Watts): 0.063W, 1/16W; .Checked PCB: used; Temperature Coefficient: ±100ppm/°C; Category: Resistors; Supplier Part Number: RMCF0402FT33R0CT-ND; Manufacturer Part Number: RMCF0402FT33R0; Package / Case: 0402 (1005 Metric); Price 1k [$]: 0.00384; Tolerance: ±1%; Value: 33R; .Checked SCH: used; Supplier: Digikey; Supplier 1: Digi-Key; Supplier Part Number 1: RMCF0402FT33R0CT-ND; RoHS: RoHS Compliant; Stock 1: 26866; Pricing 1: 1=0.04, 10=0.025, 50=0.0138, 100=0.0105, 250=0.0078, 500=0.00576, 1000=0.00384 (USD); Composition: Thick Film; Features: -; Size / Dimension: 0.039" L x 0.020" W (1.00mm x 0.50mm); Height: 0.016" (0.40mm); Number of Terminations: 2; Packaging: Cut Tape (CT); ComponentLink1URL: http://www.seielect.com/Catalog/SEI-RMCF.pdf; ComponentLink1Description: http://www.seielect.com/Catalog/SEI-RMCF.pdf
R277-R279 R283 = RMCF0402FT4K99: RES TF 4.99K OHM 1% 1/16W 0402; Manufacturer: Stackpole Electronics Inc; Power (Watts): 0.063W, 1/16W; .Checked PCB: used; Temperature Coefficient: ±100ppm/°C; Category: Resistors; Supplier Part Number: RMCF0402FT4K99CT-ND; Manufacturer Part Number: RMCF0402FT4K99; Package / Case: 0402 (1005 Metric); Price 1k [$]: 0.00384; Resistance (Ohms): 4.99K; Tolerance: ±1%; Value: 4k99; .Checked SCH: used; Supplier: Digikey; Supplier 1: Digi-Key; Supplier Part Number 1: RMCF0402FT4K99CT-ND; RoHS: RoHS Compliant; Stock 1: 48509; Pricing 1: 1=0.04, 10=0.025, 50=0.0138, 100=0.0105, 250=0.0078, 500=0.00576, 1000=0.00384 (USD); Composition: Thick Film; Features: -; Size / Dimension: 0.039" L x 0.020" W (1.00mm x 0.50mm); Height: 0.016" (0.40mm); Number of Terminations: 2; Packaging: Cut Tape (CT); ComponentLink1URL: http://www.seielect.com/Catalog/SEI-RMCF.pdf; ComponentLink1Description: http://www.seielect.com/Catalog/SEI-RMCF.pdf
R284 = RC0402FR-073KL: RES 3K OHM 1/16W 1% 0402 SMD; Manufacturer: Yageo; Power (Watts): 0.063W, 1/16W; Temperature Coefficient: ±100ppm/°C; .Creator: MM; .Checked SCH: used; Supplier 1: Digi-Key; Manufacturer Part Number: RC0402FR-073KL; RoHS: RoHS Compliant; Category: Resistors; Stock 1: 194271; Pricing 1: 1=0.1, 10=0.014, 25=0.0104, 100=0.0063, 250=0.0054, 500=0.00382, 1000=0.0027, 2500=0.00234, 5000=0.00203 (USD); Packaging: Cut Tape (CT); Resistance (Ohms): 3k; Tolerance: ±1%; Composition: Thick Film; Features: -; Package / Case: 0402 (1005 Metric); Supplier Device Package: 0402; Size / Dimension: 0.039" L x 0.020" W (1.00mm x 0.50mm); Height: 0.016" (0.40mm); Number of Terminations: 2; ComponentLink1URL: http://www.yageo.com/documents/recent/PYu-RC0402_51_RoHS_L_6.pdf; ComponentLink1Description: http://www.yageo.com/documents/recent/PYu-RC0402_51_RoHS_L_6.pdf; Supplier Part Number 1: 311-3KLRCT-ND; .Checked PCB: used
TP19 TP20 TP52-TP55 = TP_25MILC: Test Point 25mil; .Checked PCB: used
U33 = SN74AHC1G09DCKR: IC GATE AND 1CH 2-INP SC-70-5; Manufacturer: Texas Instruments; Logic Type: AND Gate; Number of Circuits: 1; Number of Inputs: 2; Voltage - Supply: 2 V ~ 5.5 V; Current - Quiescent (Max): 1µA; Current - Output High, Low: -, 8mA; Logic Level - Low: 0.5 V ~ 1.65 V; Logic Level - High: 1.5 V ~ 3.85 V; Max Propagation Delay @ V, Max CL: 7.5ns @ 5V, 50pF; .Creator: MM; .Checked SCH: used; Supplier 1: Digi-Key; Manufacturer Part Number: SN74AHC1G09DCKR; RoHS: RoHS Compliant; Category: Integrated Circuits (ICs); Stock 1: 2059; Pricing 1: 1=0.49, 10=0.345, 25=0.2836, 100=0.2265, 250=0.165, 500=0.134, 750=0.11351, 1000=0.103 (USD); Packaging: Cut Tape (CT); Features: Open Drain; Operating Temperature: -55°C ~ 125°C; Mounting Type: Surface Mount; Supplier Device Package: SC-70-5; Package / Case: 6-TSSOP (5 Lead), SC-88A, SOT-353; ComponentLink1URL: http://www.ti.com/lit/ds/symlink/sn74ahc1g09.pdf; ComponentLink1Description: http://www.ti.com/lit/ds/symlink/sn74ahc1g09.pdf; Supplier Part Number 1: 296-29203-1-ND; .Checked PCB: used
U34 = LPC1345FHN33,551: IC MCU ARM 32KB FLASH 32HVQFN; Manufacturer: NXP Semiconductors; Core Processor: ARM® Cortex®-M3; Core Size: 32-Bit; Speed: 72MHz; Connectivity: I²C, Microwire, SPI, SSI, SSP, UART/USART, USB; Peripherals: Brown-out Detect/Reset, POR, WDT; Number of I/O: 26; Program Memory Size: 32KB (32K x 8); EEPROM Size: 2K x 8; RAM Size: 10K x 8; Voltage - Supply (Vcc/Vdd): 2 V ~ 3.6 V; Data Converters: A/D 8x12b; Oscillator Type: Internal; .Checked PCB: used; .Creator: MM; Supplier 1: Digi-Key; Manufacturer Part Number: LPC1345FHN33,551; RoHS: RoHS Compliant; Category: Integrated Circuits (ICs); Stock 1: 0; Pricing 1: 260=3.2745 (USD); Packaging: Tray; Program Memory Type: FLASH; Operating Temperature: -40°C ~ 85°C; Package / Case: 32-VQFN Exposed Pad; Supplier Device Package: 32-HVQFN (7x7); ComponentLink1URL: http://www.nxp.com/documents/data_sheet/LPC1315_16_17_45_46_47.pdf; ComponentLink1Description: http://www.nxp.com/documents/data_sheet/LPC1315_16_17_45_46_47.pdf; Supplier Part Number 1: LPC1345FHN33,551-ND; .Checked SCH: used; Supplier 2: Mouser
U35 = TS5A3157DCKR: IC SWITCH SPDT SC70-6; Manufacturer: Texas Instruments; Circuit: 1 x SPDT; On-State Resistance: 10 Ohm; Voltage Supply Source: Single Supply; Voltage - Supply, Single/Dual (±): 1.65 V ~ 5.5 V; Current - Supply: 2.5µA; .Checked PCB: used; .Creator: MM; Supplier 1: Digi-Key; Manufacturer Part Number: TS5A3157DCKR; RoHS: RoHS Compliant; Category: Integrated Circuits (ICs); Stock 1: 2204; Pricing 1: 1=0.42, 10=0.325, 100=0.171, 1000=0.153 (USD); Packaging: Cut Tape (CT); Function: Switch; Operating Temperature: -40°C ~ 85°C; Mounting Type: Surface Mount; Package / Case: 6-TSSOP, SC-88, SOT-363; Supplier Device Package: SC-70-6; ComponentLink1URL: http://www.ti.com/lit/ds/symlink/ts5a3157.pdf; ComponentLink1Description: http://www.ti.com/lit/ds/symlink/ts5a3157.pdf; Supplier Part Number 1: 296-17588-1-ND; .Checked SCH: used
Y5 = 7M-12.000MAHE-T: CRYSTAL 12MHZ 12PF SMD; Manufacturer: TXC CORPORATION; Frequency Stability: ±30ppm; ESR (Equivalent Series Resistance): 100 Ohm; Operating Mode: Fundamental; .Creator: MM; .Checked PCB: used; Supplier 1: Digi-Key; Manufacturer Part Number: 7M-12.000MAHE-T; RoHS: RoHS Compliant; Category: Crystals and Oscillators; Stock 1: 2813; Pricing 1: 1=0.96, 10=0.847, 50=0.791, 100=0.7, 500=0.6615, 1000=0.553 (USD); Packaging: Cut Tape (CT); Type: MHz Crystal; Frequency: 12MHz; Frequency Tolerance: ±30ppm; Load Capacitance: 12pF; Operating Temperature: -40°C ~ 85°C; Ratings: -; Mounting Type: Surface Mount; Package / Case: 4-SMD, No Lead (DFN, LCC); Size / Dimension: 0.126" L x 0.098" W (3.20mm x 2.50mm); Height: 0.031" (0.80mm); ComponentLink1URL: http://www.txccrystal.com/images/pdf/7m.pdf; ComponentLink1Description: http://www.txccrystal.com/images/pdf/7m.pdf; Supplier Part Number 1: 887-1775-1-ND; .Checked SCH: used

## Sheet [20] - ETHERNET, SATA.SchDoc
size A3; DocumentNumber: 20; SheetNumber: 20; SheetTotal: 32
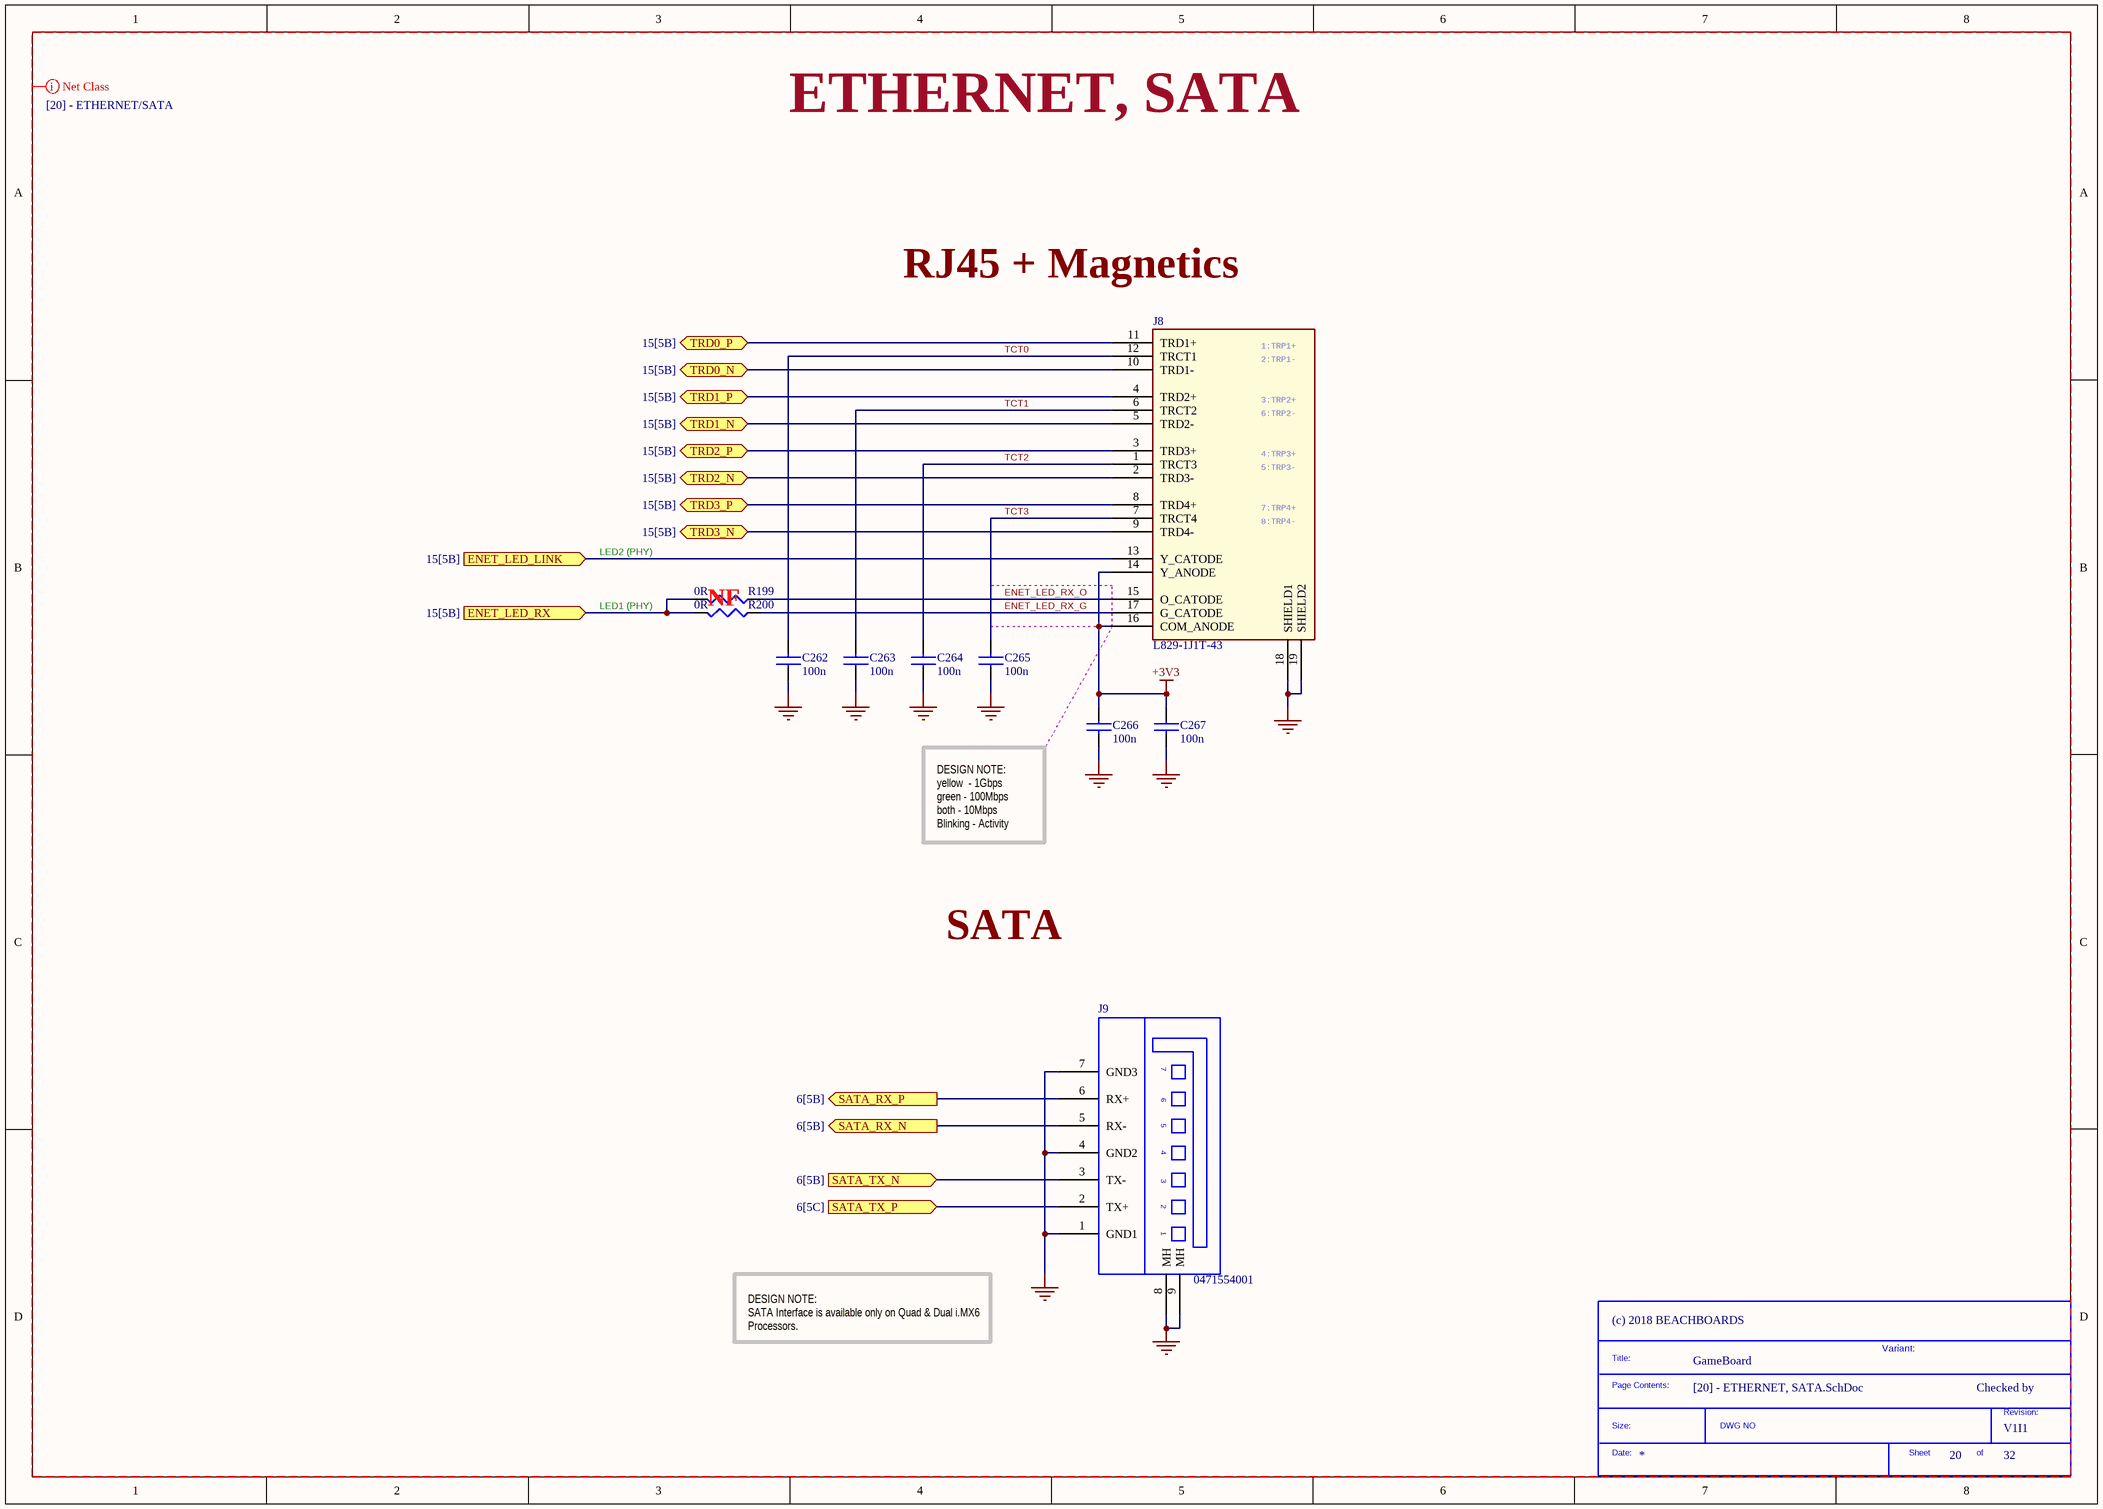
[diagram p57: [20] - ETHERNET, SATA.SchDoc]

### Parts
(Parts that share a designator on the sheet are numbered #1, #2 ... from top to bottom, then left to right.)
*#19  SDTitleBlock  (value not drawn)  (graphical)
C262  100n  [C0402]
C263  100n  [C0402]
C264  100n  [C0402]
C265  100n  [C0402]
C266  100n  [C0402]
C267  100n  [C0402]
J8  L829-1J1T-43  [L829-1J1T-43]
J9  0471554001  [SATA_VERTICAL]
R199  0R  [R0402]
R200  0R  [R0402]

### Ports
ENET_LED_LINK (in, see 15[5B]), ENET_LED_RX (in, see 15[5B]), SATA_RX_N (out, see 6[5B]), SATA_RX_P (out, see 6[5B]), SATA_TX_N (in, see 6[5B]), SATA_TX_P (in, see 6[5C]), TRD0_N (bidir, see 15[5B]), TRD0_P (bidir, see 15[5B]), TRD1_N (bidir, see 15[5B]), TRD1_P (bidir, see 15[5B]), TRD2_N (bidir, see 15[5B]), TRD2_P (bidir, see 15[5B]), TRD3_N (bidir, see 15[5B]), TRD3_P (bidir, see 15[5B])

### Nets
+3V3: C266.1 C267.1 J8.14(Y_ANODE) J8.16(COM_ANODE)
GND: C262.1 C263.1 C264.1 C265.1 C266.2 C267.2 J8.18(SHIELD1) J8.19(SHIELD2) J9.1(GND1) J9.4(GND2) J9.7(GND3) J9.8(MH) J9.9(MH)
ENET_LED_LINK: J8.13(Y_CATODE) ; port ENET_LED_LINK
ENET_LED_RX: R199.2 R200.2 ; port ENET_LED_RX
ENET_LED_RX_G: J8.17(G_CATODE) R200.1
ENET_LED_RX_O: J8.15(O_CATODE) R199.1
SATA_RX_N: J9.5(RX-) ; port SATA_RX_N
SATA_RX_P: J9.6(RX+) ; port SATA_RX_P
SATA_TX_N: J9.3(TX-) ; port SATA_TX_N
SATA_TX_P: J9.2(TX+) ; port SATA_TX_P
TCT0: C262.2 J8.12(TRCT1)
TCT1: C263.2 J8.6(TRCT2)
TCT2: C264.2 J8.1(TRCT3)
TCT3: C265.2 J8.7(TRCT4)
TRD0_N: J8.10(TRD1-) ; port TRD0_N
TRD0_P: J8.11(TRD1+) ; port TRD0_P
TRD1_N: J8.5(TRD2-) ; port TRD1_N
TRD1_P: J8.4(TRD2+) ; port TRD1_P
TRD2_N: J8.2(TRD3-) ; port TRD2_N
TRD2_P: J8.3(TRD3+) ; port TRD2_P
TRD3_N: J8.9(TRD4-) ; port TRD3_N
TRD3_P: J8.8(TRD4+) ; port TRD3_P

### Layout directives
net class [20] - ETHERNET/SATA: +3V3, ENET_LED_RX_G, ENET_LED_RX_O, GND, TCT0, TCT1, TCT2, TCT3

### Notes on the sheet
- ETHERNET, SATA
- RJ45 + Magnetics
- LED2 (PHY)
- LED1 (PHY)
- DESIGN NOTE:
  yellow  - 1Gbps
  green - 100Mbps
  both - 10Mbps
  Blinking - Activity
- SATA
- DESIGN NOTE:
  SATA Interface is available only on Quad & Dual i.MX6 Processors.
- Variant:
- Checked by
- (in symbol L829-1J1T-43) 1:TRP1+; 2:TRP1-; 3:TRP2+; 6:TRP2-; 4:TRP3+; 5:TRP3-; 7:TRP4+; 8:TRP4-
- (in symbol SDTitleBlock) Title:; Page Contents:; Revision:; Size:; DWG NO; Date:; Sheet; of

### Library data of the parts
C262-C267 = C1005X5R1H104K: as C241 on sheet [19] - USB; Category: Capacitors; Supplier Part Number: 445-5942-1-ND; Manufacturer Part Number: C1005X5R1H104K; Operating Temperature: -55°C ~ 85°C; Package / Case: 0402 (1005 Metric); Price 1k [$]: 0.02340; .Checked SCH: used; Voltage - Rated: 50V; Supplier: Digikey; Supplier 1: Digi-Key; Supplier Part Number 1: 445-5942-1-ND; RoHS: RoHS Compliant; Stock 1: 106926; Pricing 1: 1=0.27, 10=0.18, 100=0.072, 250=0.05176, 500=0.0369, 1000=0.027 (USD); Tolerance: ±10%; Temperature Coefficient: X5R; Mounting Type: Surface Mount, MLCC; Applications: General Purpose; Ratings: -; Size / Dimension: 0.039" L x 0.020" W (1.00mm x 0.50mm); Height - Seated (Max): -; Thickness (Max): 0.022" (0.55mm); Lead Spacing: -; Features: -; Packaging: Cut Tape (CT); Lead Style: -; ComponentLink1URL: http://www.tdk.co.jp/tefe02/e412_c.pdf; ComponentLink1Description: http://www.tdk.co.jp/tefe02/e412_c.pdf; Supplier 2: Digi-Key; Supplier Part Number 2: 311-1697-6-ND
J8 = L829-1J1T-43: CONN MAGJACK 1PORT SHLD 1000BT; Manufacturer: Bel Fuse Inc; Connector Type: RJ45; Number of Ports: 1; Speed: 10/100/1000 Base-T; LED Color: Green, Orange - Yellow; Number of Cores per Jack: 8; Shielding: Shielded; Tab Direction: Up; .Checked PCB: used; Supplier 1: Digi-Key; Manufacturer Part Number: L829-1J1T-43; RoHS: RoHS Compliant; Category: Connectors, Interconnects; Stock 1: 7172; Pricing 1: 1=4.67, 10=3.863, 100=2.8974, 250=2.672, 500=2.41446, 1000=2.14082, 2500=2.05229, 5000=2.01205 (GBP); Number of Rows: 1; Mounting Type: Panel Mount; Through Hole, Right Angle; Height Above Board: 0.445" (11.30mm); Features: AutoMDIX, Board Guide; Packaging: Tray; ComponentLink1URL: http://www.belfuse.com/Data/Datasheets/L829-1J1T-43.pdf; ComponentLink1Description: http://www.belfuse.com/Data/Datasheets/L829-1J1T-43.pdf; Supplier Part Number 1: 380-1110-ND; .Checked SCH: used
J9 = 0471554001: CONN SATA HDR 7POS PCB VERT; Manufacturer: Molex Inc; Connector Style: Header, Shrouded; Number of Positions: 7; .Checked PCB: used; Supplier 1: Digi-Key; Supplier Part Number 1: WM4059-ND; Manufacturer Part Number: 0471554001; RoHS: RoHS Compliant; Category: Connectors, Interconnects; Stock 1: 8065; Pricing 1: 1=1.37, 10=1.065, 25=0.9928, 50=0.9026, 100=0.8123, 250=0.68592, 500=0.6498, 1000=0.5776, 2500=0.48013 (USD); Connector Type: SATA; Mounting Type: Through Hole; Termination: Solder; Features: Board Lock; Contact Finish: Gold; Contact Finish Thickness: Flash; Packaging: Tray; ComponentLink1URL: http://www.molex.com/elqNow/elqRedir.htm?ref=http://www.molex.com/pdm_docs/sd/471554001_sd.pdf; ComponentLink1Description: http://www.molex.com/elqNow/elqRedir.htm?ref=http://www.molex.com/pdm_docs/sd/471554001_sd.pdf; .Checked SCH: used
R199 R200 = RC0402JR-070RL: as R157-R160 on sheet [19] - USB; Category: Resistors; Supplier Part Number: 311-0.0JRCT-ND; Manufacturer Part Number: RC0402JR-070RL; Package / Case: 0402 (1005 Metric); Price 1k [$]: 0.01389; Value: 0R; .Checked SCH: used; Supplier: Digikey; Supplier 1: Digi-Key; Supplier Part Number 1: 311-0.0JRCT-ND; RoHS: RoHS Compliant; Stock 1: 1106330; Pricing 1: 10=0.012, 50=0.009, 100=0.0069, 250=0.00512, 500=0.0038, 1000=0.00253 (USD); Composition: Thick Film; Features: -; Temperature Coefficient: -; Size / Dimension: 0.039" L x 0.020" W (1.00mm x 0.50mm); Height: 0.016" (0.40mm); Number of Terminations: 2; Packaging: Cut Tape (CT); ComponentLink1URL: http://www.yageo.com/documents/recent/PYu-RC0402_51_RoHS_L_6.pdf; ComponentLink1Description: http://www.yageo.com/documents/recent/PYu-RC0402_51_RoHS_L_6.pdf